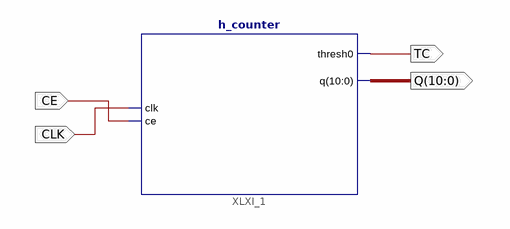
[diagram p0: schematic sheet 1]
// Xilinx ISE schematic h_counter_wrapper.sch (spartan6) as structural Verilog: 1 symbols, 4 ports
module h_counter_wrapper (
  input  CE,
  input  CLK,
  output TC,
  output [10:0] Q
);

  h_counter XLXI_1 (.clk(CLK), .ce(CE), .thresh0(TC), .q(Q));
endmodule
